# EAGLE design Davininci_rev2 (EAGLE 5.04)
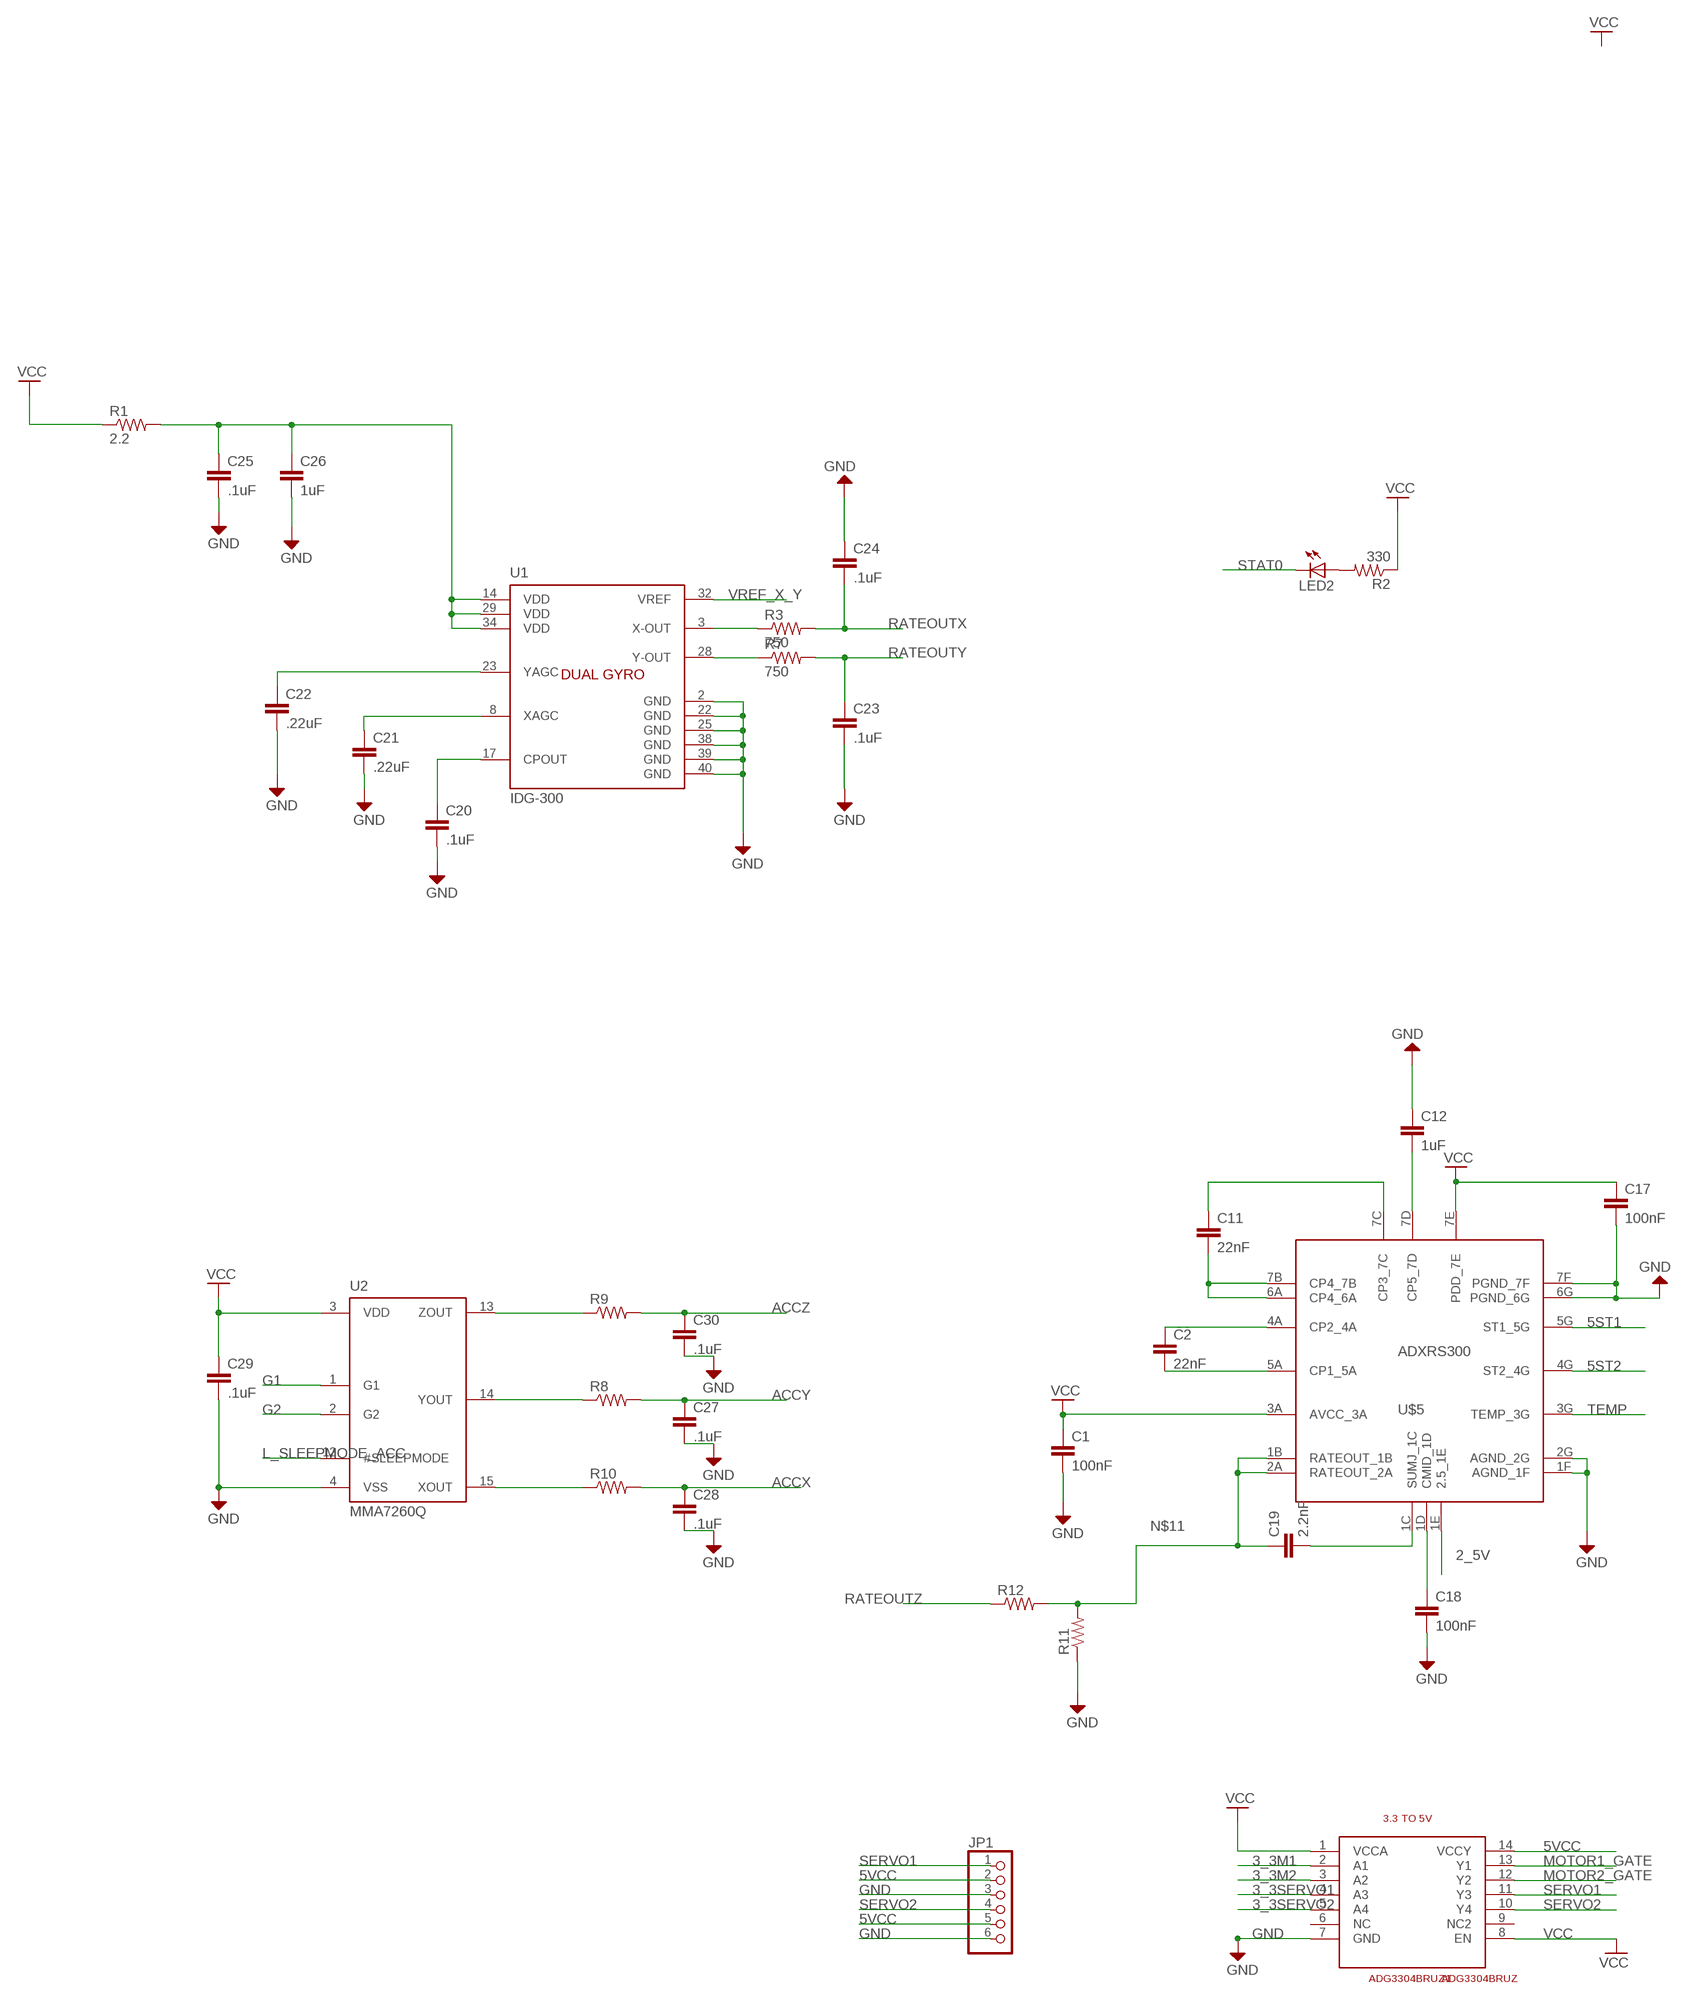
[diagram p0: schematic, sheet 1, part 1 of 2]
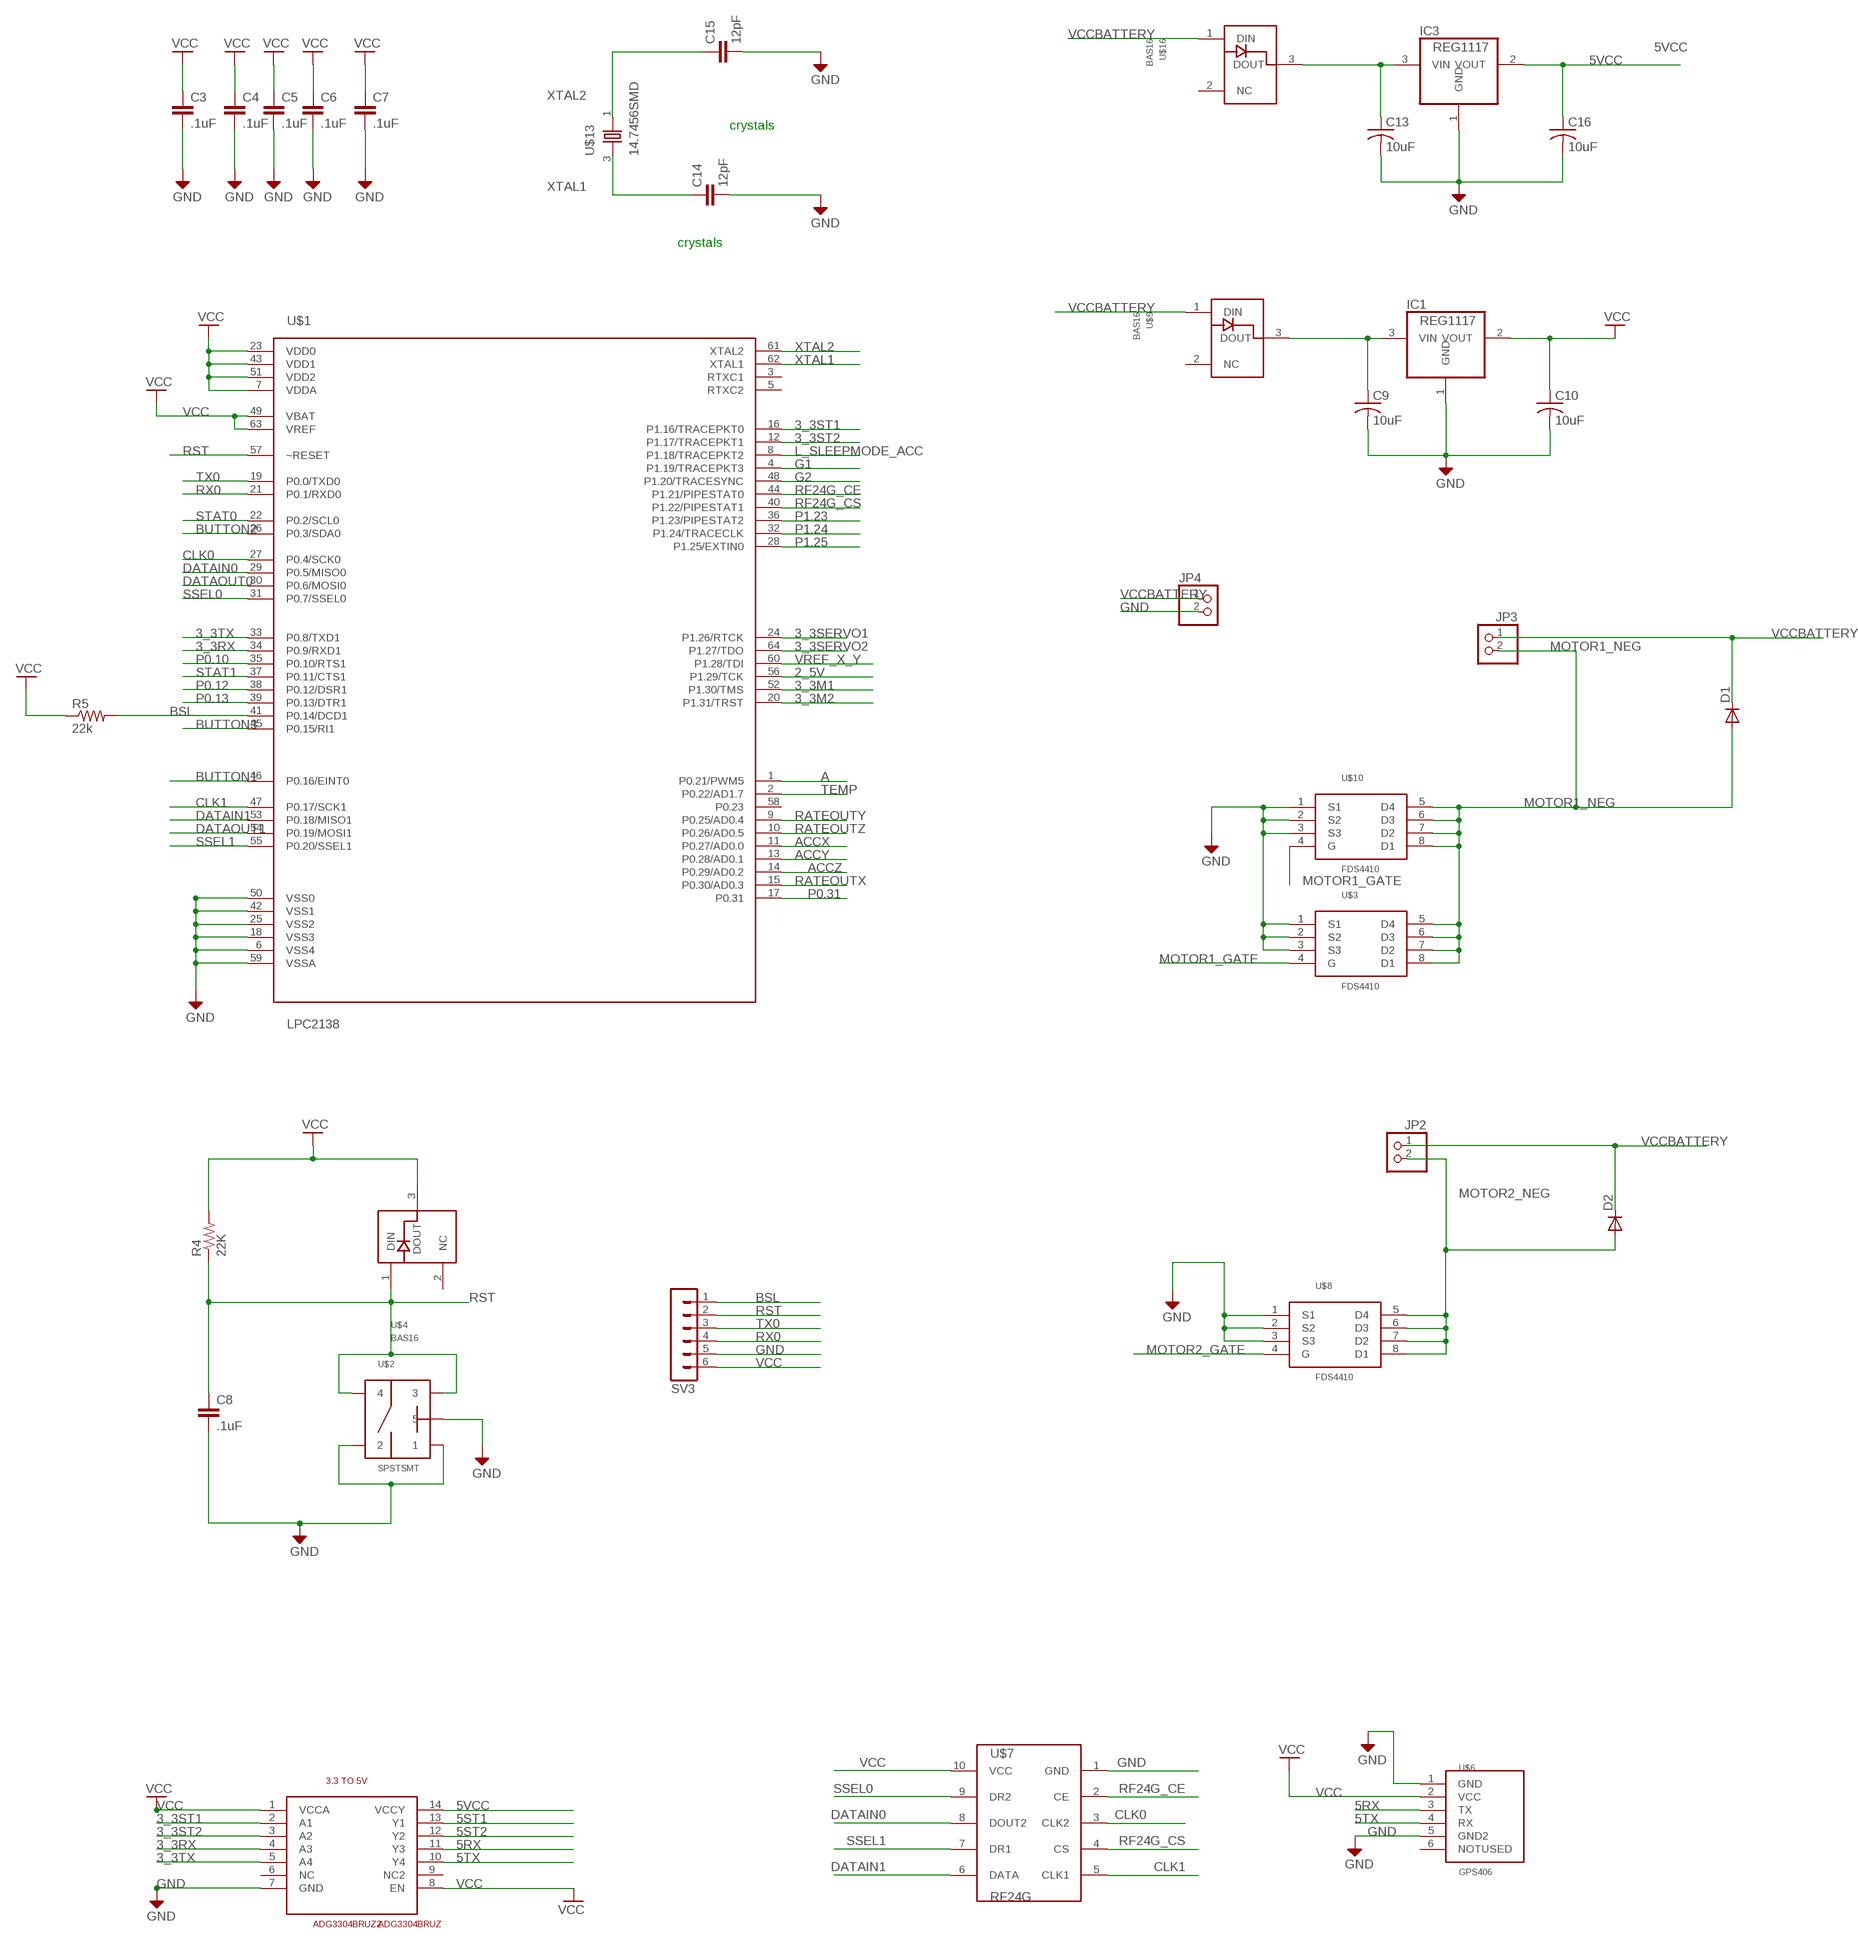
[diagram p1: schematic, sheet 1, part 2 of 2]

## Parts
ADG3304BRUZ1  ADG3304BRUZ  [TSSOP14]
ADG3304BRUZ2  ADG3304BRUZ  [TSSOP14]
C1  100nF  C-EUC0402  [C0402]
C2  22nF  C-EUC0402  [C0402]
C3  .1uF  C-EUC0402  [C0402]
C4  .1uF  C-EUC0402  [C0402]
C5  .1uF  C-EUC0402  [C0402]
C6  .1uF  C-EUC0402  [C0402]
C7  .1uF  C-EUC0402  [C0402]
C8  .1uF  C-EUC0402  [C0402]
C9  10uF  C-USC1206  [C1206]
C10  10uF  C-USC1206  [C1206]
C11  22nF  C-EUC0402  [C0402]
C12  1uF  C-EUC0402  [C0402]
C13  10uF  C-USC1206  [C1206]
C14  12pF  C-EUC0603  [C0603]
C15  12pF  C-EUC0603  [C0603]
C16  10uF  C-USC1206  [C1206]
C17  100nF  C-EUC0402  [C0402]
C18  100nF  C-EUC0402  [C0402]
C19  2.2nF  C-EUC0402  [C0402]
C20  .1uF  C-EUC0402  [C0402]
C21  .22uF  C-EUC0402  [C0402]
C22  .22uF  C-EUC0402  [C0402]
C23  .1uF  C-EUC0402  [C0402]
C24  .1uF  C-EUC0402  [C0402]
C25  .1uF  C-EUC0402  [C0402]
C26  1uF  C-EUC0402  [C0402]
C27  .1uF  C-EUC0402  [C0402]
C28  .1uF  C-EUC0402  [C0402]
C29  .1uF  C-EUC0402  [C0402]
C30  .1uF  C-EUC0402  [C0402]
D1  DIODE-DO214AC  [DO214AC]
D2  DIODE-DO214AC  [DO214AC]
IC1  REG1117  [SOT223]
IC3  REG1117  [SOT223]
JP1  PINHD-1X6  [1X06]
JP2  PINHD-1X2  [1X02]
JP3  PINHD-1X2  [1X02]
JP4  PINHD-1X2  [1X02]
LED2  LEDSMT1206  [1206]
R1  2.2  R-US_R0603  [R0603]
R2  330  R-US_R0603  [R0603]
R3  750  R-US_R0603  [R0603]
R4  22K  R-US_R0603  [R0603]
R5  22k  R-US_R0603  [R0603]
R7  750  R-US_R0603  [R0603]
R8  R-US_R0402  [R0402]
R9  R-US_R0402  [R0402]
R10  R-US_R0402  [R0402]
R11  R-US_R0402  [R0402]
R12  R-US_R0402  [R0402]
SV3  MA06-1  [MA06-1]
U1  IDG-300  [QFN-40]
U2  MMA7260Q  [QFN-16]
U$1  LPC2138  [LQFP64]
U$2  SPSTSMT  [SPSTSMT]
U$3  FDS4410  [SO-8]
U$4  BAS16  [SOT23]
U$5  ADXRS300  [CSPBGA_32]
U$6  GPS406  [GPS406CON]
U$7  RF24G  [RF24GCON]
U$8  FDS4410  [SO-8]
U$9  BAS16  [SOT23]
U$10  FDS4410  [SO-8]
U$13  14.7456SMD  [14.7456SMD]
U$16  BAS16  [SOT23]

## Nets
2_5V: U$1.56(P1.29/TCK) U$5.1E(2.5_1E)
3_3M1: ADG3304BRUZ1.2(A1) U$1.52(P1.30/TMS)
3_3M2: ADG3304BRUZ1.3(A2) U$1.20(P1.31/TRST)
3_3RX: ADG3304BRUZ2.4(A3) U$1.34(P0.9/RXD1)
3_3SERVO1: ADG3304BRUZ1.4(A3) U$1.24(P1.26/RTCK)
3_3SERVO2: ADG3304BRUZ1.5(A4) U$1.64(P1.27/TDO)
3_3ST1: ADG3304BRUZ2.2(A1) U$1.16(P1.16/TRACEPKT0)
3_3ST2: ADG3304BRUZ2.3(A2) U$1.12(P1.17/TRACEPKT1)
3_3TX: ADG3304BRUZ2.5(A4) U$1.33(P0.8/TXD1)
5RX: ADG3304BRUZ2.11(Y3) U$6.3(TX)
5ST1: ADG3304BRUZ2.13(Y1) U$5.5G(ST1_5G)
5ST2: ADG3304BRUZ2.12(Y2) U$5.4G(ST2_4G)
5TX: ADG3304BRUZ2.10(Y4) U$6.4(RX)
5VCC: ADG3304BRUZ1.14(VCCY) ADG3304BRUZ2.14(VCCY) C16.1 IC3.2(VOUT) JP1.2 JP1.5
A: U$1.1(P0.21/PWM5)
ACCX: C28.1 R10.2 U$1.11(P0.27/AD0.0)
ACCY: C27.1 R8.2 U$1.13(P0.28/AD0.1)
ACCZ: C30.1 R9.2 U$1.14(P0.29/AD0.2)
BSL: R5.2 SV3.1 U$1.41(P0.14/DCD1)
BUTTON1: U$1.46(P0.16/EINT0)
BUTTON2: U$1.26(P0.3/SDA0)
BUTTON3: U$1.45(P0.15/RI1)
CLK0: U$1.27(P0.4/SCK0) U$7.3(CLK2)
CLK1: U$1.47(P0.17/SCK1) U$7.5(CLK1)
DATAIN0: U$1.29(P0.5/MISO0) U$7.8(DOUT2)
DATAIN1: U$1.53(P0.18/MISO1) U$7.6(DATA)
DATAOUT0: U$1.30(P0.6/MOSI0)
DATAOUT1: U$1.54(P0.19/MOSI1)
G1: U2.1(G1) U$1.4(P1.19/TRACEPKT3)
G2: U2.2(G2) U$1.48(P1.20/TRACESYNC)
GND: ADG3304BRUZ1.7(GND) ADG3304BRUZ2.7(GND) C1.2 C3.2 C4.2 C5.2 C6.2 C7.2 C8.2 C9.2 C10.2 C12.1 C13.2 C14.2 C15.2 C16.2 C17.2 C18.2 C20.2 C21.2 C22.2 C23.2 C24.1 C25.2 C26.2 C27.2 C28.2 C29.2 C30.2 IC1.1(GND) IC3.1(GND) JP1.3 JP1.6 JP4.2 R11.1 SV3.5 U1.2(GND) U1.22(GND) U1.25(GND) U1.38(GND) U1.39(GND) U1.40(GND) U2.4(VSS) U$1.6(VSS4) U$1.18(VSS3) U$1.25(VSS2) U$1.42(VSS1) U$1.50(VSS0) U$1.59(VSSA) U$2.1 U$2.2 U$2.5 U$3.1(S1) U$3.2(S2) U$3.3(S3) U$5.1F(AGND_1F) U$5.2G(AGND_2G) U$5.6G(PGND_6G) U$5.7F(PGND_7F) U$6.1(GND) U$6.5(GND2) U$7.1(GND) U$8.1(S1) U$8.2(S2) U$8.3(S3) U$10.1(S1) U$10.2(S2) U$10.3(S3)
L_SLEEPMODE_ACC: U2.12(#SLEEPMODE) U$1.8(P1.18/TRACEPKT2)
MOTOR1_GATE: ADG3304BRUZ1.13(Y1) U$3.4(G) U$10.4(G)
MOTOR1_NEG: D1.A JP3.2 U$3.5(D4) U$3.6(D3) U$3.7(D2) U$3.8(D1) U$10.5(D4) U$10.6(D3) U$10.7(D2) U$10.8(D1)
MOTOR2_GATE: ADG3304BRUZ1.12(Y2) U$8.4(G)
MOTOR2_NEG: D2.A JP2.2 U$8.5(D4) U$8.6(D3) U$8.7(D2) U$8.8(D1)
N$1: C25.1 C26.1 R1.2 U1.14(VDD) U1.29(VDD) U1.34(VDD)
N$2: C2.2 U$5.5A(CP1_5A)
N$3: C2.1 U$5.4A(CP2_4A)
N$4: C11.2 U$5.6A(CP4_6A) U$5.7B(CP4_7B)
N$5: C11.1 U$5.7C(CP3_7C)
N$6: C12.2 U$5.7D(CP5_7D)
N$7: R7.1 U1.28(Y-OUT)
N$8: LED2.A R2.2
N$9: R3.1 U1.3(X-OUT)
N$11: C19.1 R11.2 R12.2 U$5.1B(RATEOUT_1B) U$5.2A(RATEOUT_2A)
N$12: C22.1 U1.23(YAGC)
N$13: C19.2 U$5.1C(SUMJ_1C)
N$15: C18.1 U$5.1D(CMID_1D)
N$16: C21.1 U1.8(XAGC)
N$18: C13.1 IC3.3(VIN) U$16.3(DOUT)
N$19: C20.1 U1.17(CPOUT)
N$23: C9.1 IC1.3(VIN) U$9.3(DOUT)
N$27: R9.1 U2.13(ZOUT)
N$28: R8.1 U2.14(YOUT)
N$29: R10.1 U2.15(XOUT)
P0.10: U$1.35(P0.10/RTS1)
P0.12: U$1.38(P0.12/DSR1)
P0.13: U$1.39(P0.13/DTR1)
P0.31: U$1.17(P0.31)
P1.23: U$1.36(P1.23/PIPESTAT2)
P1.24: U$1.32(P1.24/TRACECLK)
P1.25: U$1.28(P1.25/EXTIN0)
RATEOUTX: C24.2 R3.2 U$1.15(P0.30/AD0.3)
RATEOUTY: C23.1 R7.2 U$1.9(P0.25/AD0.4)
RATEOUTZ: R12.1 U$1.10(P0.26/AD0.5)
RF24G_CE: U$1.44(P1.21/PIPESTAT0) U$7.2(CE)
RF24G_CS: U$1.40(P1.22/PIPESTAT1) U$7.4(CS)
RST: C8.1 R4.1 SV3.2 U$1.57(~RESET) U$2.3 U$2.4 U$4.1(DIN)
RX0: SV3.4 U$1.21(P0.1/RXD0)
SERVO1: ADG3304BRUZ1.11(Y3) JP1.1
SERVO2: ADG3304BRUZ1.10(Y4) JP1.4
SSEL0: U$1.31(P0.7/SSEL0) U$7.9(DR2)
SSEL1: U$1.55(P0.20/SSEL1) U$7.7(DR1)
STAT0: LED2.C U$1.22(P0.2/SCL0)
STAT1: U$1.37(P0.11/CTS1)
TEMP: U$1.2(P0.22/AD1.7) U$5.3G(TEMP_3G)
TX0: SV3.3 U$1.19(P0.0/TXD0)
VCC: ADG3304BRUZ1.1(VCCA) ADG3304BRUZ1.8(EN) ADG3304BRUZ2.1(VCCA) ADG3304BRUZ2.8(EN) C1.1 C3.1 C4.1 C5.1 C6.1 C7.1 C10.1 C17.1 C29.1 IC1.2(VOUT) R1.1 R2.1 R4.2 R5.1 SV3.6 U2.3(VDD) U$1.7(VDDA) U$1.23(VDD0) U$1.43(VDD1) U$1.49(VBAT) U$1.51(VDD2) U$1.63(VREF) U$4.3(DOUT) U$5.3A(AVCC_3A) U$5.7E(PDD_7E) U$6.2(VCC) U$7.10(VCC)
VCCBATTERY: D1.C D2.C JP2.1 JP3.1 JP4.1 U$9.1(DIN) U$16.1(DIN)
VREF_X_Y: U1.32(VREF) U$1.60(P1.28/TDI)
XTAL1: C14.1 U$1.62(XTAL1) U$13.3
XTAL2: C15.1 U$1.61(XTAL2) U$13.1
Unconnected: ADG3304BRUZ1.6(NC) ADG3304BRUZ1.9(NC2) ADG3304BRUZ2.6(NC) ADG3304BRUZ2.9(NC2) U1.1(RESV) U1.4(NC) U1.5(NC) U1.6(NC) U1.7(NC) U1.9(RESV) U1.10(RESV) U1.11(RESV) U1.12(RESV) U1.13(RESV) U1.15(RESV) U1.16(RESV) U1.18(RESV) U1.19(RESV) U1.20(RESV) U1.21(RESV) U1.24(NC) U1.26(NC) U1.27(NC) U1.30(RESV) U1.31(RESV) U1.33(RESV) U1.35(RESV) U1.36(RESV) U1.37(RESV) U$1.3(RTXC1) U$1.5(RTXC2) U$1.58(P0.23) U$4.2(NC) U$6.6(NOTUSED) U$9.2(NC) U$16.2(NC)

## Notes on the sheet
- crystals
- crystals

## Library data of the parts
ADG3304BRUZ1 ADG3304BRUZ2 = TXCVR:ADG3304BRUZ
C1-C8 C11 C12 C14 C15 C17-C30 = rcl:C-EU: CAPACITOR, European symbol
C9 C10 C13 C16 = rcl:C-US: CAPACITOR, American symbol
D1 D2 = diode:DIODE-: DIODE
IC1 IC3 = burr-brown:REG1117: 800mA and 1A Low Dropout (LDO) Positive Regulator 1.8V, 2.5V, 2.85V, 3.3V, 5V, and Adj
JP1 = pinhead:PINHD-1X6: PIN HEADER
JP2-JP4 = pinhead:PINHD-1X2: PIN HEADER
LED2 = led:LED: LED OSRAM: - CHIPLED LG R971, LG N971, LY N971, LG Q971, LY Q971, LO R971, LY R971 LH N974, LH R974 LS Q976, LO Q976, LY Q976 LO Q996 - Hyper CHIPLED LW Q18S LB Q993, LB Q99A, LB R99A - SideLED LS A670, LO A670, LY A670, LG A670, LP A670 LB A673, LV A673, LT A673, LW A673 LH A674 LY A675 LS A676, LA A676, LO A676, LY A676, LW A676 LS A679, LY A679, LG A679 - Hyper Micro SIDELED® LS Y876, LA Y876, LO Y876, LY Y876 LT Y87S - SmartLED LW L88C, LW L88S LB L89C, LB L89S, LG L890 LS L89K, LO L89K, LY L89K LS L896, LA L896, LO L896, LY L896 - TOPLED LS T670, LO T670, LY T670, LG T670, LP T670 LSG T670, LSP T670, LSY T670, LOP T670, LYG T670 LG T671, LOG T671, LSG T671 LB T673, LV T673, LT T673, LW T673 LH T674 LS T676, LA T676, LO T676, LY T676, LB T676, LH T676, LSB T676, LW T676 LB T67C, LV T67C, LT T67C, LS T67K, LO T67K, LY T67K, LW E67C LS E67B, LA E67B, LO E67B, LY E67B, LB E67C, LV E67C, LT E67C LW T67C LS T679, LY T679, LG T679 LS T770, LO T770, LY T770, LG T770, LP T770 LB T773, LV T773, LT T773, LW T773 LH T774 LS E675, LA E675, LY E675, LS T675 LS T776, LA T776, LO T776, LY T776, LB T776 LHGB T686 LT T68C, LB T68C - Hyper Mini TOPLED® LB M676 - Mini TOPLED Santana® LG M470 LS M47K, LO M47K, LY M47K Source: http://www.osram.convergy.de/
R1-R5 R7-R12 = rcl:R-US_: RESISTOR, American symbol
SV3 = con-lstb:MA06-1: PIN HEADER
U1 = m-pad-2.0:IDG-300: InvenSense's IDG-300 Integrated Dual-Axis Gyro Description: The IDG-300 is an integrated dual-axis angular rate sensor (gyroscope). It uses InvenSense?s proprietary and patented MEMS technology with vertically driven, vibrating masses to make a functionally complete, lowcost, dual-axis angular rate sensor. All required electronics are integrated onto a single chip with the sensor. The IDG-300 gyro uses two sensor elements with novel vibrating dual-mass bulk silicon configurations that sense the rate of rotation about the X- and Y-axis (in-plane sensing). This results in a unique, integrated dual-axis gyro with guaranteed-by-design vibration rejection and high cross-axis isolation. It is specifically designed for demanding consumer applications requiring low cost, small size and high performance. The IDG-300 gyro includes integrated electronics necessary for application-ready functionality. It incorporates X- and Y-axis low-pass filters and an EEPROM for on-chip factory calibration of the sensor. Factory trimmed scale factors eliminate the need for external active components and end-user calibration. This product is lead-free and Green Compliant. Features: Integrated X- and Y-axis gyro on a single chip Factory trimmed full scale range of ±500°/sec Integrated low-pass filters Superior vibration rejection over a wide frequency range High cross-axis isolation by design 3V single supply operation 5000 g shock tolerance RoHS compliant (completely lead free) 6 x 6 x 1.5mm QFN package Applications: Inertial measurement units (IMUs) Handheld GPS navigation devices Radio controlled helicopters Toys and game consoles Robotic and power tools Antenna positioning Remote control Please send any comments to: messi@users.sourceforge.net
U2 = m-pad-2.0:MMA7260Q: Freescale Semiconductor's MMA7260Q ±1.5g - 6g Three Axis Low-g Micromachined Accelerometer Description: The MMA7260Q low cost capacitive micromachined accelerometer features signal conditioning, a 1-pole low pass filter, temperature compensation and g-Select which allows for the selection among 4 sensitivities. Zero-g offset full scale span and filter cut-off are factory set and require no external devices. Includes a Sleep Mode that makes it ideal for handheld battery powered electronics. Features: Selectable Sensitivity (1.5g/2g/4g/6g) Low Current Consumption: 500 µA Sleep Mode: 3 µA Low Voltage Operation: 2.2 V  3.6 V 6mm x 6mm x 1.45mm QFN High Sensitivity (800 mV/g @1.5 g) Fast Turn On Time High Sensitivity (1.5 g) Integral Signal Conditioning with Low Pass Filter Robust Design, High Shocks Survivability Pb-Free Terminations Environmentally Preferred Package Low Cost Typical Applications: HDD MP3 Player : Freefall Detection Laptop PC : Freefall Detection, Anti-Theft Cell Phone : Image Stability, Text Scroll, Motion Dialing, E-Compass Pedometer : Motion Sensing PDA : Text Scroll Navigation and Dead Reckoning : E-Compass Tilt Compensation Gaming : Tilt and Motion Sensing, Event Recorder Robotics : Motion Sensing Please send any comments to: messi@users.sourceforge.net
U$1 = m-pad-2.0:LPC2138
U$2 = m-pad-2.0:SPSTSMT
U$3 U$8 U$10 = m-pad-2.0:FDS4410
U$4 U$9 U$16 = TXCVR:BAS16
U$5 = analog-devices:ADXRS300
U$6 = m-pad-2.0:GPS406
U$7 = m-pad-2.0:RF24G
U$13 = m-pad-2.0:14.7456SMD

## Board
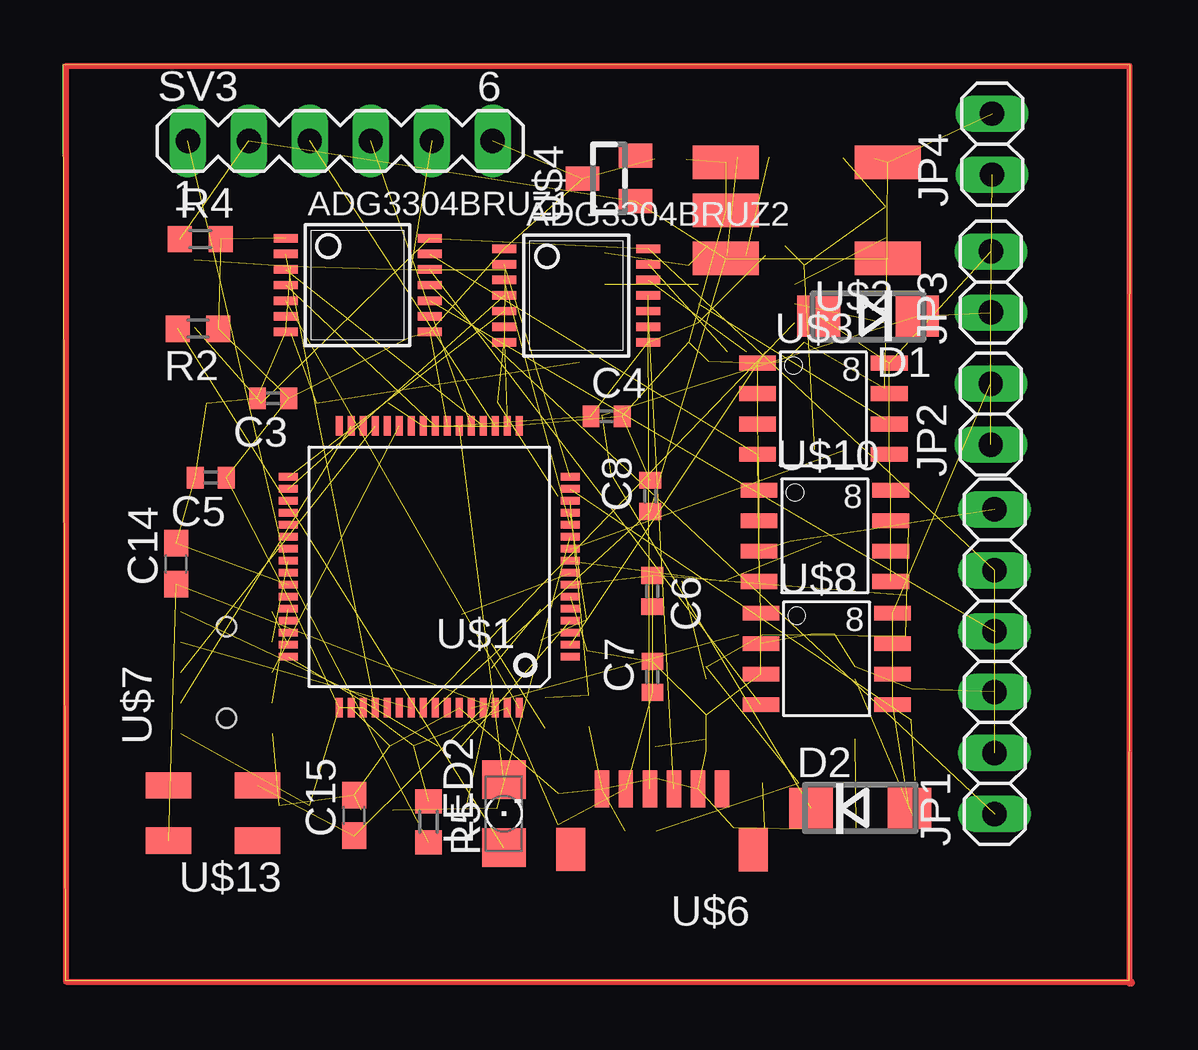
[diagram p2: board, top side]
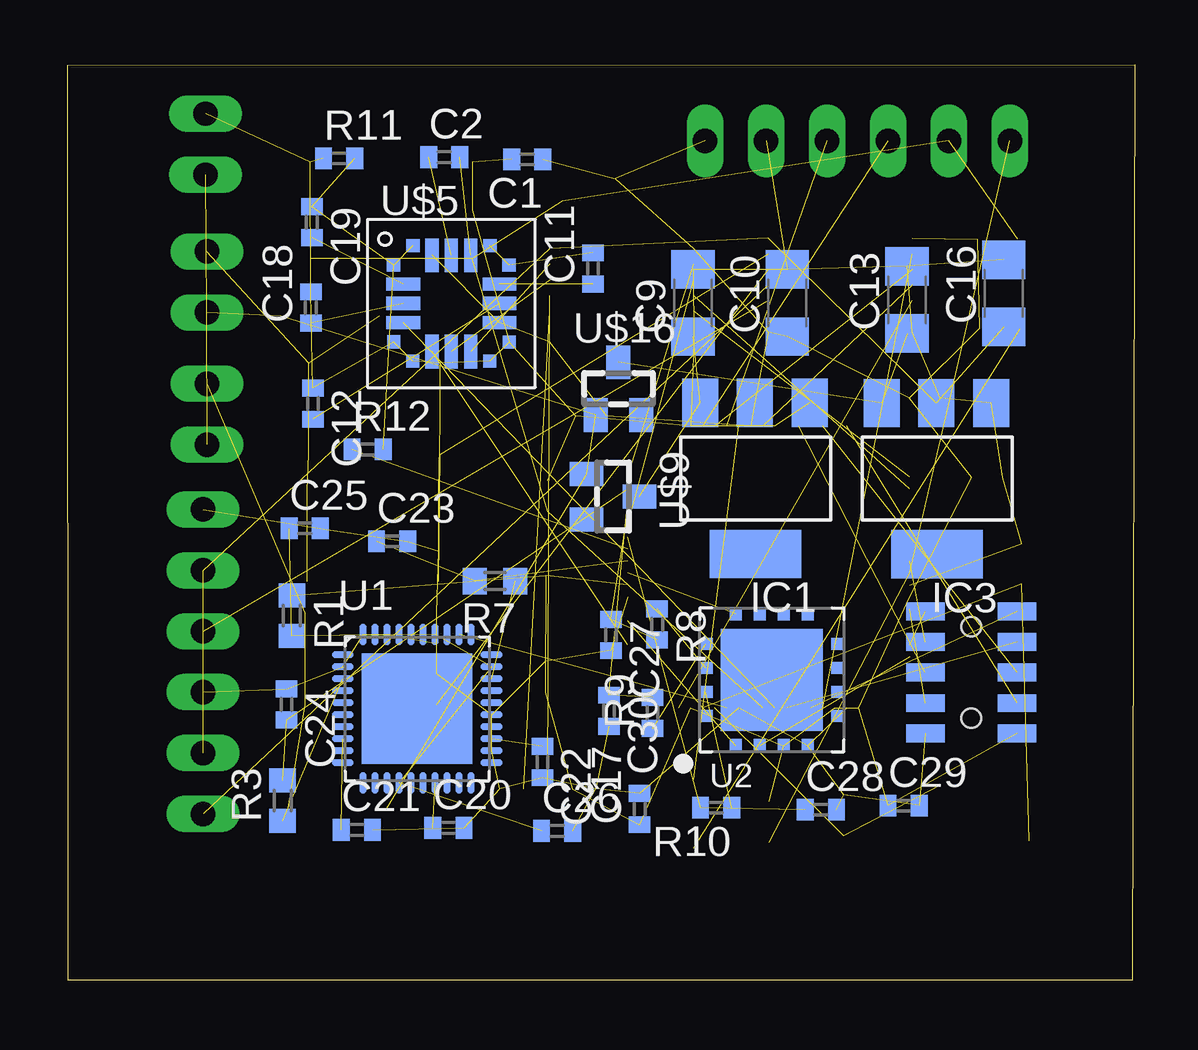
[diagram p3: board, bottom side, seen from below]

Size 44.46 x 38.17 mm. Coordinates in mm from the lower left corner, seen from the top.
Outline: 0.1,0.02 44.44,0 44.46,38.15 0,38.17 0.1,0.02
Copper layers (1*16): Top 0.035mm / dielectric 1.5mm / Bottom 0.035mm
Design rules "default": minimum track width 5mil, minimum drill 5mil, track to track 5mil, track to pad 5mil, pad to pad 5mil, via to via 5mil, smd to smd 5mil, copper to edge 40mil, drill to drill 5mil, minimum pad ring 10mil, minimum via ring 10mil, stop-mask expansion 4mil, vias tented up to drill 0mil, thermal gap 10mil

### Footprints (pad centres in the part's own frame; a part is rotated, then mirrored left to right if it is on the bottom)
TSSOP14 = smd 0.35 x 1: 1 -1.95,-3; 2 -1.3,-3; 3 -0.65,-3; 4 0,-3; 5 0.65,-3; 6 1.3,-3; 7 1.95,-3; 8 1.95,3; 9 1.3,3; 10 0.65,3; 11 0,3; 12 -0.65,3; 13 -1.3,3; 14 -1.95,3
C0402 = smd 0.7 x 0.9: 1 -0.65,0; 2 0.65,0
C1206 = smd 1.6 x 1.8: 1 -1.4,0; 2 1.4,0
C0603 = smd 1.1 x 1: 1 -0.85,0; 2 0.85,0
DO214AC = smd 1.8 x 1.7: A 2.05,0; C -2.05,0
SOT223 = smd 1.499 x 2.007: 1 -2.261,-3.15; 2 0.025,-3.15; 3 2.311,-3.15 | smd 3.81 x 2.007: 4 0,3.15
1X06 = drill 1.016 long: 1 -6.35,0; 2 -3.81,0; 3 -1.27,0; 4 1.27,0; 5 3.81,0; 6 6.35,0
1X02 = drill 1.016 long: 1 -1.27,0; 2 1.27,0
1206 = smd 1.6 x 1.803: A -1.422,0; C 1.422,0
R0603 = smd 1 x 1.1: 1 -0.85,0; 2 0.85,0
R0402 = smd 0.7 x 0.9: 1 -0.65,0; 2 0.65,0
MA06-1 = drill 1.016 long: 1 -6.35,0; 2 -3.81,0; 3 -1.27,0; 4 1.27,0; 5 3.81,0; 6 6.35,0
QFN-40 = smd 0.9 x 0.3: 1 -3.1,2.25; 2 -3.1,1.75; 3 -3.1,1.25; 4 -3.1,0.75; 5 -3.1,0.25; 6 -3.1,-0.25; 7 -3.1,-0.75; 8 -3.1,-1.25; 9 -3.1,-1.75; 10 -3.1,-2.25; 21 3.1,-2.25; 22 3.1,-1.75; 23 3.1,-1.25; 24 3.1,-0.75; 25 3.1,-0.25; 26 3.1,0.25; 27 3.1,0.75; 28 3.1,1.25; 29 3.1,1.75; 30 3.1,2.25 | smd 0.3 x 0.9: 11 -2.25,-3.1; 12 -1.75,-3.1; 13 -1.25,-3.1; 14 -0.75,-3.1; 15 -0.25,-3.1; 16 0.25,-3.1; 17 0.75,-3.1; 18 1.25,-3.1; 19 1.75,-3.1; 20 2.25,-3.1; 31 2.25,3.1; 32 1.75,3.1; 33 1.25,3.1; 34 0.75,3.1; 35 0.25,3.1; 36 -0.25,3.1; 37 -0.75,3.1; 38 -1.25,3.1; 39 -1.75,3.1; 40 -2.25,3.1 | smd 4.6 x 4.6: P$1 0,0
QFN-16 = smd 0.5 x 0.55: 1 -1.5,-2.75; 2 -0.5,-2.75; 3 0.5,-2.75; 4 1.5,-2.75; 9 1.5,2.75; 10 0.5,2.75; 11 -0.5,2.75; 12 -1.5,2.75 | smd 0.55 x 0.5: 5 2.75,-1.5; 6 2.75,-0.5; 7 2.75,0.5; 8 2.75,1.5; 13 -2.75,1.5; 14 -2.75,0.5; 15 -2.75,-0.5; 16 -2.75,-1.5 | smd 4.25 x 4.25: P$1 0,0
LQFP64 = smd 0.8 x 0.3: 1 -5.875,3.75; 2 -5.875,3.25; 3 -5.875,2.75; 4 -5.875,2.25; 5 -5.875,1.75; 6 -5.875,1.25; 7 -5.875,0.75; 8 -5.875,0.25; 9 -5.875,-0.25; 10 -5.875,-0.75; 11 -5.875,-1.25; 12 -5.875,-1.75; 13 -5.875,-2.25; 14 -5.875,-2.75; 15 -5.875,-3.25; 16 -5.875,-3.75; 33 5.875,-3.75; 34 5.875,-3.25; 35 5.875,-2.75; 36 5.875,-2.25; 37 5.875,-1.75; 38 5.875,-1.25; 39 5.875,-0.75; 40 5.875,-0.25; 41 5.875,0.25; 42 5.875,0.75; 43 5.875,1.25; 44 5.875,1.75; 45 5.875,2.25; 46 5.875,2.75; 47 5.875,3.25; 48 5.875,3.75 | smd 0.3 x 0.8: 17 -3.75,-5.875; 18 -3.25,-5.875; 19 -2.75,-5.875; 20 -2.25,-5.875; 21 -1.75,-5.875; 22 -1.25,-5.875; 23 -0.75,-5.875; 24 -0.25,-5.875; 25 0.25,-5.875; 26 0.75,-5.875; 27 1.25,-5.875; 28 1.75,-5.875; 29 2.25,-5.875; 30 2.75,-5.875; 31 3.25,-5.875; 32 3.75,-5.875; 49 3.75,5.875; 50 3.25,5.875; 51 2.75,5.875; 52 2.25,5.875; 53 1.75,5.875; 54 1.25,5.875; 55 0.75,5.875; 56 0.25,5.875; 57 -0.25,5.875; 58 -0.75,5.875; 59 -1.25,5.875; 60 -1.75,5.875; 61 -2.25,5.875; 62 -2.75,5.875; 63 -3.25,5.875; 64 -3.75,5.875
SPSTSMT = smd 2.75 x 1.4: 1 3.376,-2.001; 2 -3.377,-2.005; 3 3.376,2.001; 4 -3.377,2.005; 5 3.376,0
SO-8 = smd 1.524 x 0.61: 1 -2.743,1.27; 2 -2.743,0; 3 -2.743,-1.27; 4 -2.743,-2.54; 5 2.743,-2.54; 6 2.743,-1.27; 7 2.743,0; 8 2.743,1.27
SOT23 = smd 1 x 1.4: 1 -0.95,-1.1; 2 0.95,-1.1; 3 0,1.1
CSPBGA_32 = smd 0.55 x 0.55: 1B -2.407,1.607; 1F -2.405,-1.601; 2A -1.601,2.405; 2G -1.607,-2.407; 6A 1.607,2.407; 6G 1.601,-2.405; 7B 2.405,1.601; 7F 2.407,-1.607 | smd 1.4 x 0.55: 1C -2.004,0.804; 1D -2.004,0; 1E -2.004,-0.804; 7C 2.004,0.804; 7D 2.004,0; 7E 2.004,-0.804 | smd 0.55 x 1.4: 3A -0.804,2.004; 3G -0.804,-2.004; 4A 0,2.004; 4G 0,-2.004; 5A 0.804,2.004; 5G 0.804,-2.004
GPS406CON = smd 0.6 x 1.55: 1 3.003,0; 2 2.009,0; 3 1.004,0; 4 0,0; 5 -1.004,0; 6 -2.009,0 | smd 1.2 x 1.8: P$1 -3.305,2.528; P$8 4.306,2.523
RF24GCON = smd 0.74 x 1.6 bottom: 1 -2.541,-1.909; 2 -1.277,-1.909; 3 0,-1.909; 4 1.277,-1.909; 5 2.541,-1.909; 6 2.541,1.909; 7 1.277,1.909; 8 0,1.909; 9 -1.277,1.909; 10 -2.541,1.909 | hole 0.8: 1.907,0; -1.906,0
14.7456SMD = smd 1.9 x 1.1: 1 -1.852,-1.152; 2 1.852,-1.152; 3 1.852,1.152; 4 -1.852,1.152

### Placement (x,y rotation side)
ADG3304BRUZ1  12.27,28.99 270 top
ADG3304BRUZ2  21.39,28.55 270 top
C1  25.31,34.23 180 bottom
C2  28.77,34.32 0 bottom
C3  8.75,24.27 180 top
C4  22.65,23.52 0 top
C5  6.15,20.96 180 top
C6  24.55,16.23 270 top
C7  24.56,12.65 90 top
C8  24.47,20.2 90 top
C9  18.41,28.24 90 bottom
C10  14.48,28.24 90 bottom
C11  22.58,29.68 90 bottom
C12  34.24,24.05 270 bottom
C13  9.49,28.37 90 bottom
C14  4.72,17.37 90 top
C15  12.13,6.88 90 top
C16  5.46,28.65 90 bottom
C17  20.63,7.15 90 bottom
C18  34.33,28.05 90 bottom
C19  34.29,31.61 270 bottom
C20  28.6,6.36 0 bottom
C21  32.41,6.28 0 bottom
C22  24.68,9.1 270 bottom
C23  30.94,18.3 0 bottom
C24  35.35,11.51 270 bottom
C25  34.59,18.85 0 bottom
C26  24.07,6.24 0 bottom
C27  21.83,14.4 270 bottom
C28  13.08,7.12 0 bottom
C29  9.63,7.29 0 bottom
C30  21.91,11.25 270 bottom
D1  33.54,27.7 180 top
D2  33.22,7.17 0 top
IC1  15.8,20.93 180 bottom
IC3  8.24,20.92 180 bottom
JP1  38.82,13.29 90 top
JP2  38.66,23.61 90 top
JP3  38.67,29.12 90 top
JP4  38.71,34.86 90 top
LED2  18.37,6.96 90 top
R1  35.12,15.2 270 bottom
R2  5.62,27.17 180 top
R3  35.51,7.5 90 bottom
R4  5.72,30.9 0 top
R5  15.23,6.61 270 top
R7  26.66,16.65 180 bottom
R8  19.9,14.84 270 bottom
R9  20.09,11.15 90 bottom
R10  17.44,7.2 180 bottom
R11  33.16,34.27 0 bottom
R12  31.97,22.14 0 bottom
SV3  11.55,35 0 top
U1  29.9,11.33 0 bottom
U2  15.12,12.54 0 bottom
U$1  15.26,17.24 180 top
U$2  30.99,32.1 180 top
U$3  31.68,24.47 0 top
U$4  22.75,33.43 90 top
U$5  28.48,28.22 0 bottom
U$6  25.46,7.99 180 top
U$7  6.82,12.84 90 top
U$8  31.82,14.04 0 top
U$9  21.74,20.17 270 bottom
U$10  31.75,19.17 0 top
U$13  6.25,6.98 180 top
U$16  21.52,24.67 0 bottom

### Tracks (layer width: path | path; a pad name or v marks a point on that pad's centre or on a via)
2_5V  (1 unrouted)
3_3M1  (1 unrouted)
3_3M2  (1 unrouted)
3_3RX  (1 unrouted)
3_3SERVO1  (1 unrouted)
3_3SERVO2  (1 unrouted)
3_3ST1  (1 unrouted)
3_3ST2  (1 unrouted)
3_3TX  (1 unrouted)
5RX  (1 unrouted)
5ST1  (1 unrouted)
5ST2  (1 unrouted)
5TX  (1 unrouted)
5VCC  (5 unrouted)
ACCX  (2 unrouted)
ACCY  (2 unrouted)
ACCZ  (2 unrouted)
BSL  (2 unrouted)
CLK0  (1 unrouted)
CLK1  (1 unrouted)
DATAIN0  (1 unrouted)
DATAIN1  (1 unrouted)
G1  (1 unrouted)
G2  (1 unrouted)
GND  (67 unrouted)
L_SLEEPMODE_ACC  (1 unrouted)
MOTOR1_GATE  (2 unrouted)
MOTOR1_NEG  (9 unrouted)
MOTOR2_GATE  (1 unrouted)
MOTOR2_NEG  (5 unrouted)
N$1  (5 unrouted)
N$2  (1 unrouted)
N$3  (1 unrouted)
N$4  (2 unrouted)
N$5  (1 unrouted)
N$6  (1 unrouted)
N$7  (1 unrouted)
N$8  (1 unrouted)
N$9  (1 unrouted)
N$10
  Top 0.254: 0.13,38.12 0.13,-0.05 44.53,-0.05 44.53,-0.14 44.44,-0.14 44.44,38.12 0.22,38.12
N$11  (4 unrouted)
N$12  (1 unrouted)
N$13  (1 unrouted)
N$15  (1 unrouted)
N$16  (1 unrouted)
N$18  (2 unrouted)
N$19  (1 unrouted)
N$23  (2 unrouted)
N$27  (1 unrouted)
N$28  (1 unrouted)
N$29  (1 unrouted)
RATEOUTX  (2 unrouted)
RATEOUTY  (2 unrouted)
RATEOUTZ  (1 unrouted)
RF24G_CE  (1 unrouted)
RF24G_CS  (1 unrouted)
RST  (6 unrouted)
RX0  (1 unrouted)
SERVO1  (1 unrouted)
SERVO2  (1 unrouted)
SSEL0  (1 unrouted)
SSEL1  (1 unrouted)
STAT0  (1 unrouted)
TEMP  (1 unrouted)
TX0  (1 unrouted)
VCC  (30 unrouted)
VCCBATTERY  (6 unrouted)
VREF_X_Y  (1 unrouted)
XTAL1  (2 unrouted)
XTAL2  (2 unrouted)

### Text on the board
_tsilk: SV3 | 6 | 1 | R4 | ADG3304BRUZ1 | ADG3304BRUZ2 | U$4 | JP4 | U$2 | U$3 | D1 | JP3 | R2 | 8 | C3 | C4 | U$10 | JP2 | C5 | C8 | 8 | C14 | C6 | U$8 | U$1 | 8 | C7 | U$7 | D2 | R5 | C15 | LED2 | JP1 | U$13 | U$6
_bsilk: C2 | R11 | C1 | U$5 | C19 | C11 | C16 | C18 | C13 | C10 | C9 | U$16 | C12 | R12 | U$9 | C25 | C23 | IC3 | IC1 | R8 | R7 | U1 | R1 | C27 | C30 | C24 | R9 | C22 | C29 | C28 | U2 | R10 | C17 | C26 | C20 | C21 | R3